# EAGLE design PIC_HP_LED_2023_01_22_A (EAGLE 9.6.1)
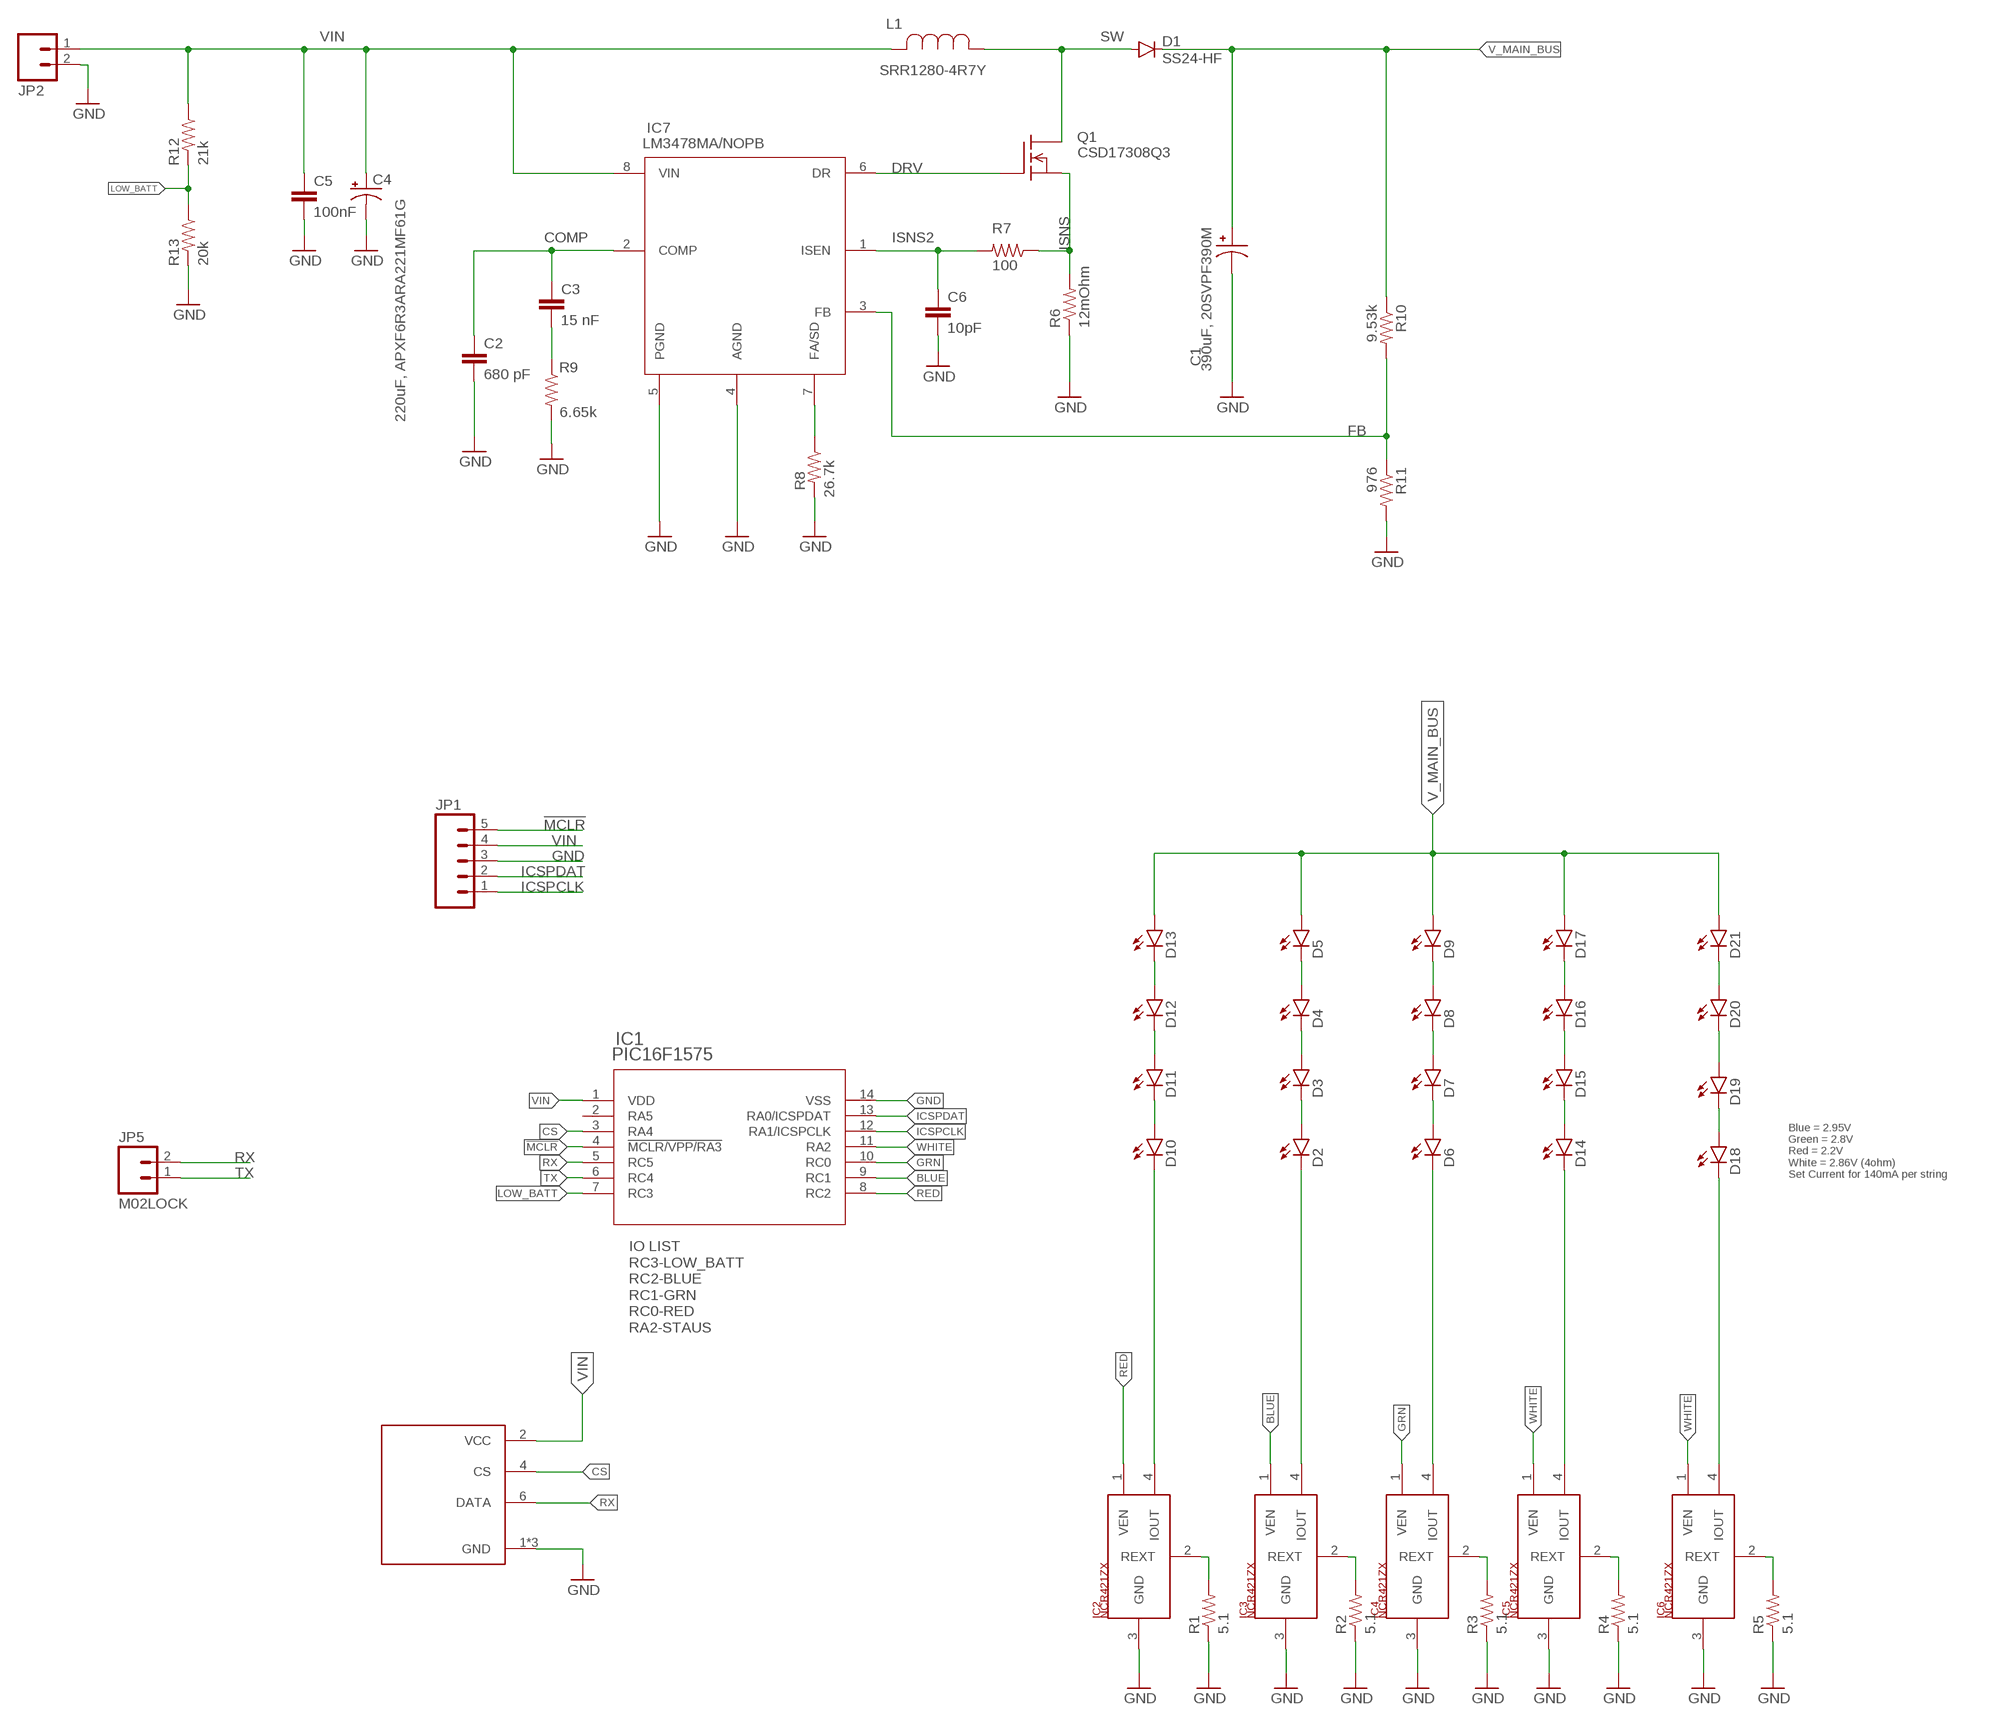
[diagram p0: schematic, sheet 1]

## Parts
C1  390uF, 20SVPF390M  20SVPF390M  [CAP_20SVPF390M]
C2  680 pF  CAP0805  [0805]
C3  15 nF  CAP0805  [0805]
C4  220uF, APXF6R3ARA221MF61G  CPOL-USUD-5X5,8  [UD-5X5,8_NICHICON]
C5  100nF  CAP0805  [0805]
C6  10pF  CAP0805  [0805]
D1  SS24-HF  DIODESMA-ALT  [SMA-DIODE_ALT]
D2  JE2835_B_G  [JE2835_BLUE]
D3  JE2835_B_G  [JE2835_BLUE]
D4  JE2835_B_G  [JE2835_BLUE]
D5  JE2835_B_G  [JE2835_BLUE]
D6  JE2835_B_G  [JE2835_BLUE]
D7  JE2835_B_G  [JE2835_BLUE]
D8  JE2835_B_G  [JE2835_BLUE]
D9  JE2835_B_G  [JE2835_BLUE]
D10  JE2835_B_G  [JE2835_BLUE]
D11  JE2835_B_G  [JE2835_BLUE]
D12  JE2835_B_G  [JE2835_BLUE]
D13  JE2835_B_G  [JE2835_BLUE]
D14  JE2835_B_G  [JE2835_BLUE]
D15  JE2835_B_G  [JE2835_BLUE]
D16  JE2835_B_G  [JE2835_BLUE]
D17  JE2835_B_G  [JE2835_BLUE]
D18  JE2835_B_G  [JE2835_BLUE]
D19  JE2835_B_G  [JE2835_BLUE]
D20  JE2835_B_G  [JE2835_BLUE]
D21  JE2835_B_G  [JE2835_BLUE]
IC1  PIC16F1575  PIC16F1503-I/SL  [SOIC14_SL]
IC2  NCR421ZX  [SOT223]
IC3  NCR421ZX  [SOT223]
IC4  NCR421ZX  [SOT223]
IC5  NCR421ZX  [SOT223]
IC6  NCR421ZX  [SOT223]
IC7  LM3478MA/NOPB  [M08A]
JP1  M05LOCK  [1X05_LOCK]
JP2  M02LOCK_LONGPADS  [1X02_LOCK_LONGPADS]
JP5  M02LOCK  [1X02_LOCK]
L1  SRR1280-4R7Y  SRR1260-100M  [IND_BOURNS_SRR1260]
Q1  CSD17308Q3  [TRANS_CSD17308Q3]
R1  5.1  RESISTOR1206  [1206]
R2  5.1  RESISTOR1206  [1206]
R3  5.1  RESISTOR1206  [1206]
R4  5.1  RESISTOR1206  [1206]
R5  5.1  RESISTOR1206  [1206]
R6  12mOhm  RESISTOR0805-RES  [0805]
R7  100  RESISTOR0805-RES  [0805]
R8  26.7k  RESISTOR0805-RES  [0805]
R9  6.65k  RESISTOR0805-RES  [0805]
R10  9.53k  RESISTOR0805-RES  [0805]
R11  976  RESISTOR0805-RES  [0805]
R12  21k  RESISTOR0805-RES  [0805]
R13  20k  RESISTOR0805-RES  [0805]
U$1  C2847244/YUANR4A  [C2847244/R4A]

## Nets
!MCLR: IC1.4(!MCLR/VPP/RA3) JP1.5
BLUE: IC1.9(RC1) IC3.1(VEN)
BLUE-: D2.C IC3.4(IOUT)
COMP: C2.1 C3.1 IC7.2(COMP)
CS: IC1.3(RA4) U$1.4(CS)
DRV: IC7.6(DR) Q1.G
FB: IC7.3(FB) R10.2 R11.1
GND: C1.2 C2.2 C4.- C5.2 C6.2 IC1.14(VSS) IC2.3(GND) IC3.3(GND) IC4.3(GND) IC5.3(GND) IC6.3(GND) IC7.4(AGND) IC7.5(PGND) JP1.3 JP2.2 R1.1 R2.1 R3.1 R4.1 R5.1 R6.1 R8.2 R9.2 R11.2 R13.2 U$1.1(GND) U$1.3(GND) U$1.5(GND)
GRN: IC1.10(RC0) IC4.1(VEN)
GRN-: D6.C IC4.4(IOUT)
ICSPCLK: IC1.12(RA1/ICSPCLK) JP1.1
ICSPDAT: IC1.13(RA0/ICSPDAT) JP1.2
ISNS: Q1.S1(S) Q1.S2(S) Q1.S3(S) R6.2 R7.1
ISNS2: C6.1 IC7.1(ISEN) R7.2
LOW_BATT: IC1.7(RC3) R12.2 R13.1
N$1: D10.A D11.C
N$2: D6.A D7.C
N$3: D2.A D3.C
N$4: D3.A D4.C
N$5: D7.A D8.C
N$6: D11.A D12.C
N$7: D12.A D13.C
N$8: D8.A D9.C
N$9: D4.A D5.C
N$10: IC2.2(REXT) R1.2
N$11: IC3.2(REXT) R2.2
N$12: IC4.2(REXT) R3.2
N$13: IC5.2(REXT) R4.2
N$14: D14.A D15.C
N$15: D15.A D16.C
N$16: D16.A D17.C
N$17: D14.C IC5.4(IOUT)
N$18: D18.A D19.C
N$19: D19.A D20.C
N$20: D20.A D21.C
N$21: D18.C IC6.4(IOUT)
N$22: IC6.2(REXT) R5.2
N$27: IC7.7(FA/SD) R8.1
N$31: C3.2 R9.1
RED: IC1.8(RC2) IC2.1(VEN)
RED-: D10.C IC2.4(IOUT)
RX: IC1.5(RC5) JP5.2 U$1.6(DATA)
SW: D1.A L1.1 Q1.5-8(D)
TX: IC1.6(RC4) JP5.1
V_MAIN_BUS: C1.1 D1.C D5.A D9.A D13.A D17.A D21.A R10.1
VIN: C4.+ C5.1 IC1.1(VDD) IC7.8(VIN) JP1.4 JP2.1 L1.2 R12.1 U$1.2(VCC)
WHITE: IC1.11(RA2) IC5.1(VEN) IC6.1(VEN)
Unconnected: IC1.2(RA5)

## Notes on the sheet
- Blue = 2.95V
  Green = 2.8V
  Red = 2.2V
  White = 2.86V (4ohm)
  Set Current for 140mA per string
- IO LIST
  RC3-LOW_BATT
  RC2-BLUE 
  RC1-GRN 
  RC0-RED
  RA2-STAUS

## Library data of the parts
C1 = 20SVPF390M:20SVPF390M: Check availability <https://pricing.snapeda.com/parts/20SVPF390M/Panasonic/view-part?ref=eda>; AVAILABILITY: In Stock; DESCRIPTION: 390F 20V Aluminum - Polymer Capacitors Radial, Can - SMD 14mOhm 5000 Hrs @ 105C; MF: Panasonic; MP: 20SVPF390M; PACKAGE: RADIAL-2 Panasonic; PRICE: None; PURCHASE-URL: https://pricing.snapeda.com/search/part/20SVPF390M/?ref=eda
C2 C3 C5 C6 = SparkFun-Capacitors:CAP: Capacitor Standard 0603 ceramic capacitor, and 0.1" leaded capacitor.
C4 = rcl:CPOL-US: POLARIZED CAPACITOR, American symbol; SPICEPREFIX: C
D1 = SparkFun-DiscreteSemi:DIODE: Diode These are standard reverse protection diodes and small signal diodes. SMA package can handle up to about 1A. SOD-323 can handle about 200mA. What the SOD-323 package when ordering, there are some mfgs out there that are 5-pin packages.
D2-D21 = Cree2835:JE2835_B_G: Footprint for JE2835 BLUE or GREEN Mid-Power LEDs - Single Color 2835 Mid-Power ColorGreen 520-540nm Mid-Power LEDs - Single Color 2835 Mid-Power ColorBlue 465-480nm Blue and Red have different foot prints.
IC1 = PIC16F15323:PIC16F1503-I/SL; BUILT_BY: EMA_UL_Team; MANUFACTURER_PART_NUMBER: PIC16F1503-I/SL; VENDOR: Microchip
IC2-IC6 = NCR421ZX:NCR421ZX
IC7 = LM3478MA:LM3478MA/NOPB; COPYRIGHT: Copyright (C) 2022 Ultra Librarian. All rights reserved.; DIGI-KEY_PART_NUMBER_1: LM3478MA/NOPB-ND; MANUFACTURER_PART_NUMBER: LM3478MA/NOPB; MFR_NAME: Texas Instruments
JP1 = SparkFun-Connectors:M05: Header 5 Standard 5-pin 0.1" header. Use with straight break away headers (SKU : PRT-00116), right angle break away headers (PRT-00553), swiss pins (PRT-00743), machine pins (PRT-00117), and female headers (PRT-00115). Molex polarized connector foot print use with SKU : PRT-08230 with associated crimp pins and housings.
JP2 JP5 = SparkFun-Connectors:M02: Standard 2-pin 0.1" header. Use with - straight break away headers ( PRT-00116) - right angle break away headers (PRT-00553) - swiss pins (PRT-00743) - machine pins (PRT-00117) - female headers (PRT-00115) Molex polarized connector foot print use with: PRT-08233 with associated crimp pins and housings. 2.54_SCREWTERM for use with PRT-10571. 3.5mm Screw Terminal footprints for PRT-08084 5mm Screw Terminal footprints for use with PRT-08432
L1 = SRR1260 Series:SRR1260-100M; COPYRIGHT: Copyright (C) 2021 Ultra Librarian. All rights reserved.; DIGI-KEY_PART_NUMBER_1: SRR1260-100MCT-ND; DIGI-KEY_PART_NUMBER_2: SRR1260-100MDKR-ND; DIGI-KEY_PART_NUMBER_3: SRR1260-100MTR-ND; MANUFACTURER_PART_NUMBER: SRR1260-100M; MFR_NAME: Bourns Electronics
Q1 = CSD17308Q3:CSD17308Q3: Check availability <https://pricing.snapeda.com/parts/CSD17308Q3/Texas%20Instruments/view-part?ref=eda>; AVAILABILITY: In Stock; DESCRIPTION: 30-V, N channel NexFET™ power MOSFET, single SON 3 mm x 3 mm, 11.8 mOhm; MF: Texas Instruments; MP: CSD17308Q3; PACKAGE: VSON-CLIP-8 Texas Instruments; PRICE: None; PURCHASE-URL: https://pricing.snapeda.com/search/part/CSD17308Q3/?ref=eda
R1-R13 = SparkFun-Resistors:RESISTOR: Resistor Basic schematic elements and footprints for 0603, 1206, and PTH resistors.
U$1 = Feng Niao RF Library:C2847244/YUANR4A: Feng Niao RF C2847244 Yuan R4A small, red, rectangular module with built in antenna. With sleep pin.

## Board
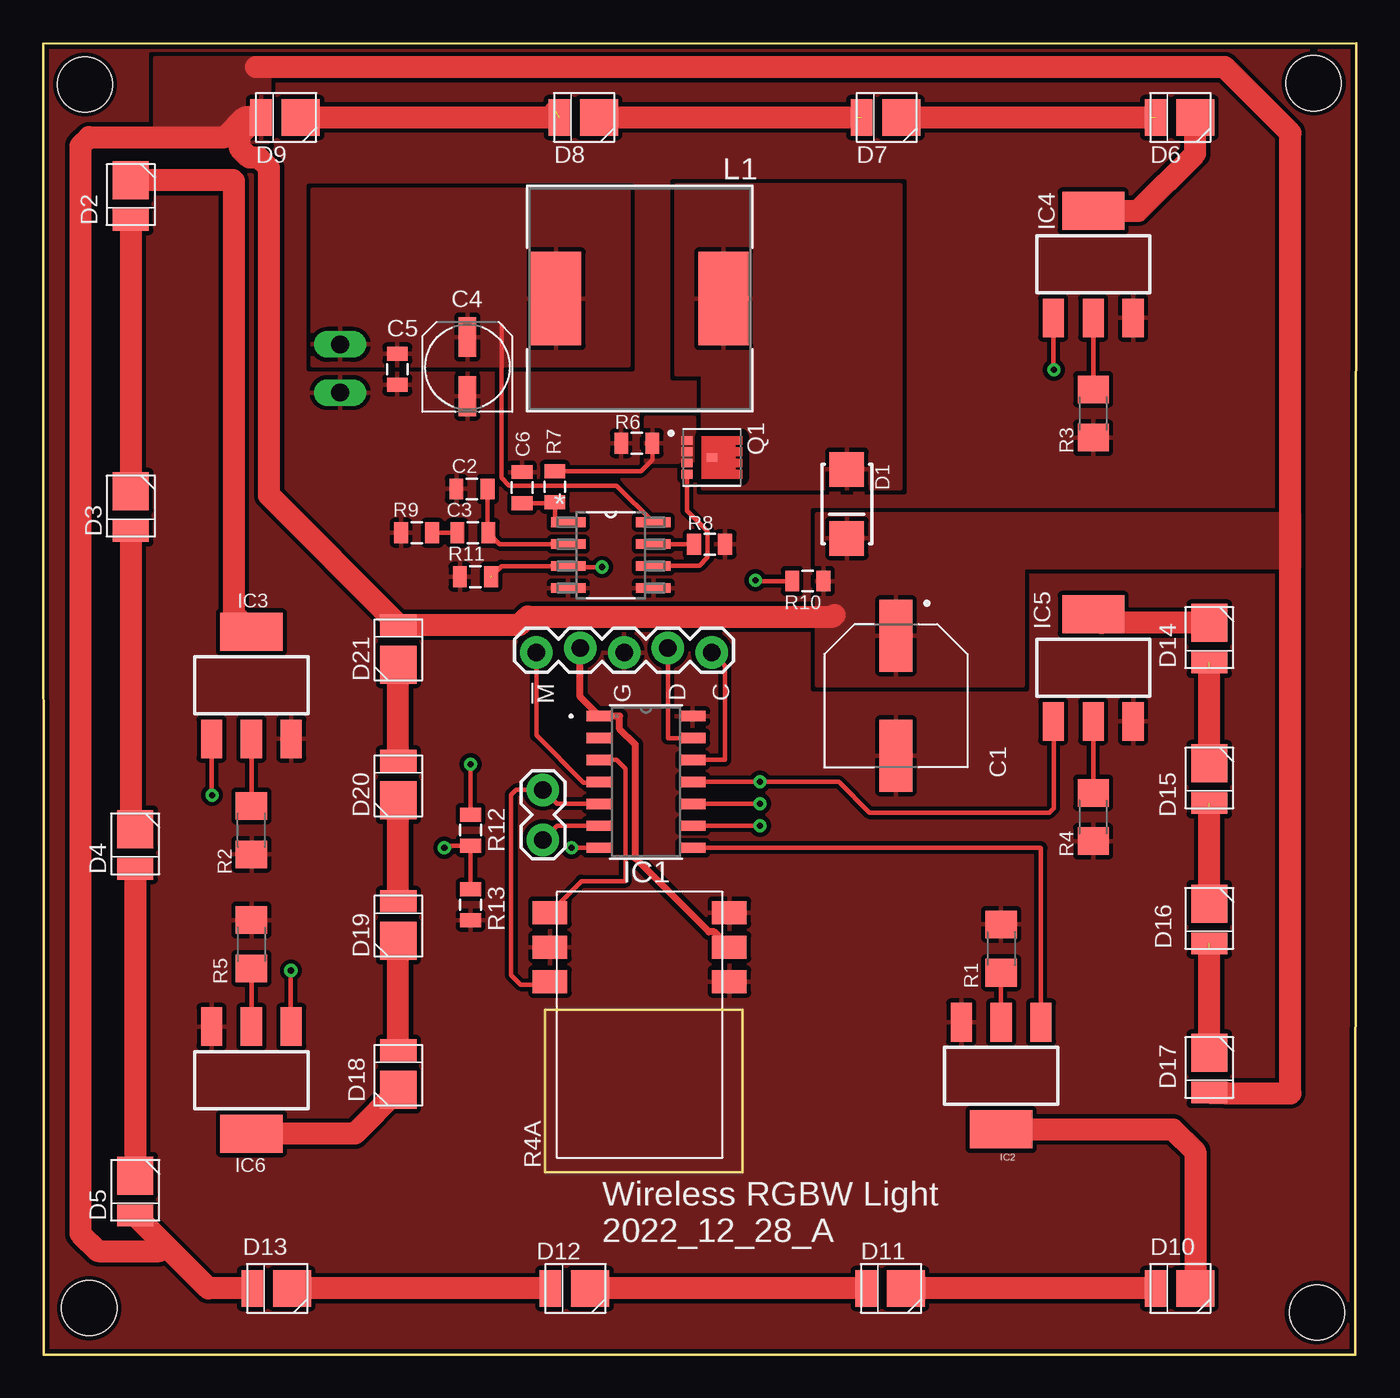
[diagram p1: board, top side]
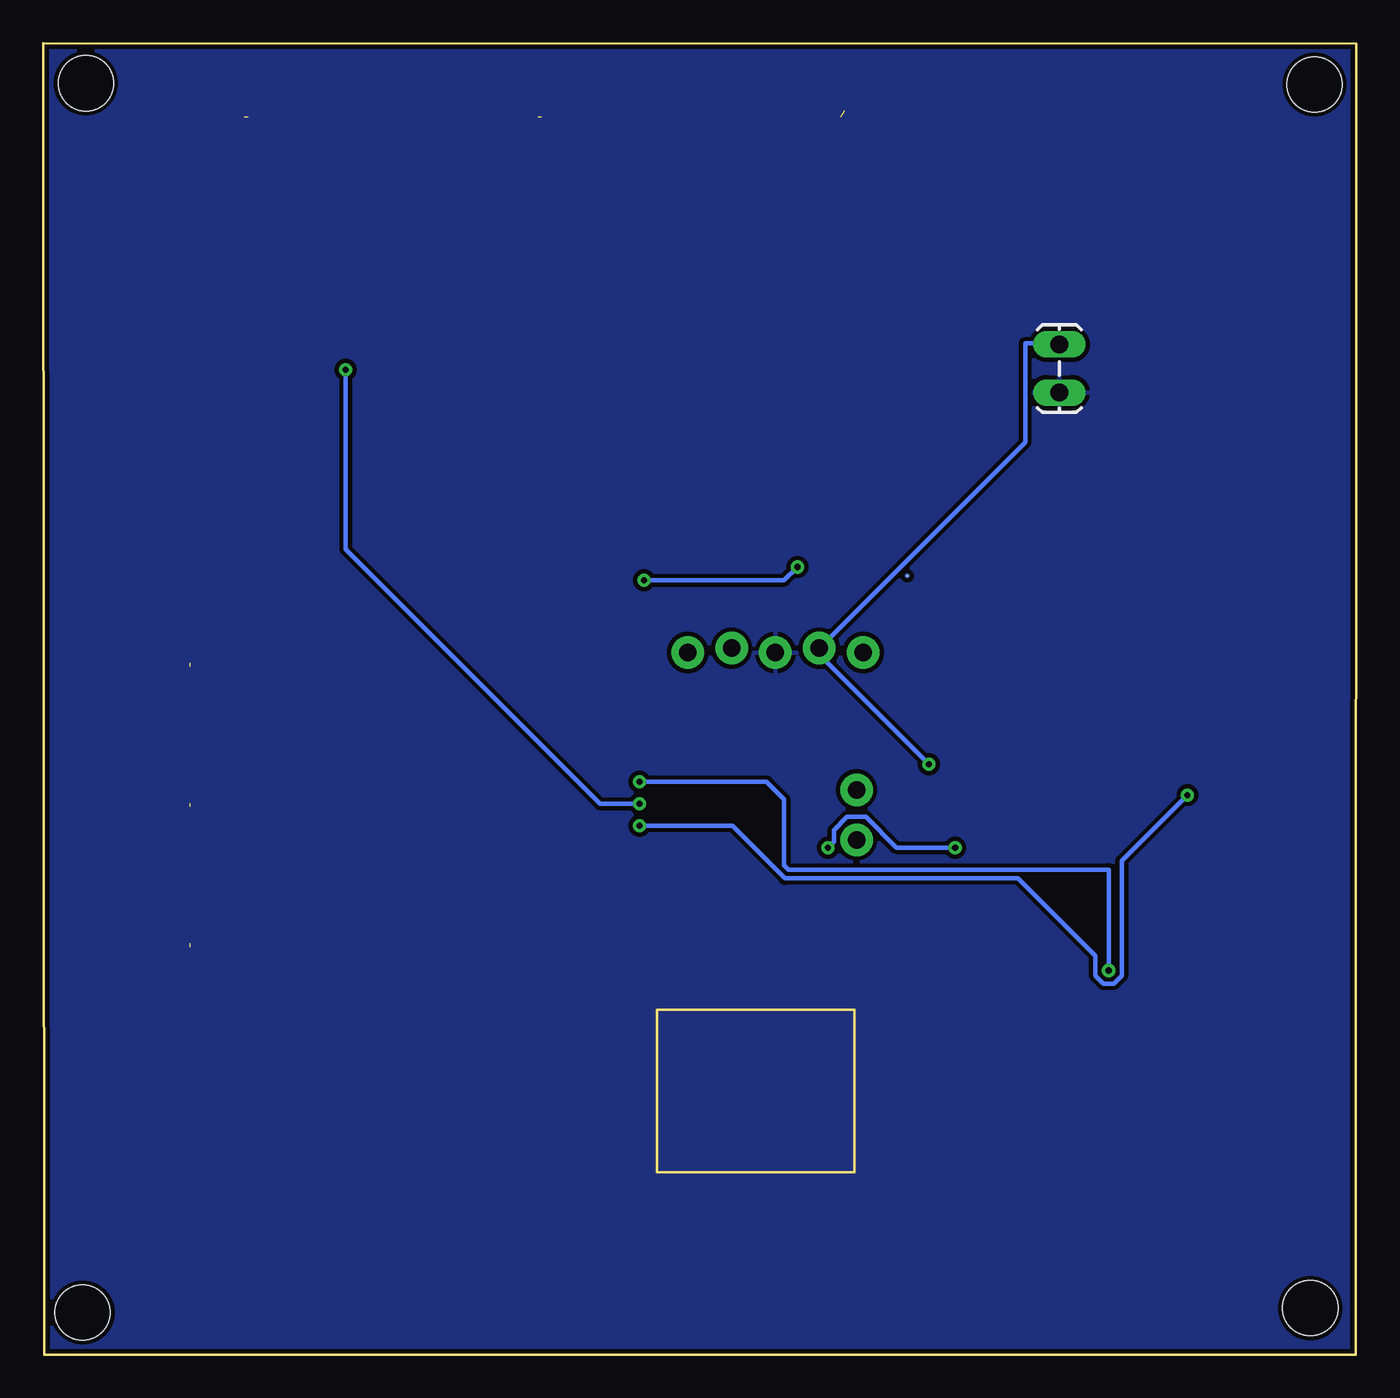
[diagram p2: board, bottom side, seen from below]

Size 76.08 x 75.96 mm. Coordinates in mm from the lower left corner, seen from the top.
Outline: 76.08,75.96 76.02,0 0.05,0 0,75.93 76.08,75.96
Copper layers (1*16): Top 0.035mm / dielectric 1.5mm / Bottom 0.035mm
Design rules "default": minimum track width 10mil, minimum drill 0.35mm, track to track 10mil, track to pad 10mil, pad to pad 10mil, via to via 10mil, smd to smd 6mil, copper to edge 10mil, drill to drill 6mil, minimum pad ring 10mil, minimum via ring 8mil, stop-mask expansion 4mil, vias tented up to drill 0mil, thermal gap 10mil
Holes 3.17 mm at 2.67,2.69 2.41,73.56 73.61,73.64 73.79,2.44
Milling: area 29.1,10.6 to 40.5,20

### Footprints (pad centres in the part's own frame; a part is rotated, then mirrored left to right if it is on the bottom)
CAP_20SVPF390M = smd 4.15 x 1.9: 1 -3.475,0; 2 3.475,0
0805 = smd 0.8 x 1.2: 1 -0.9,0; 2 0.9,0
UD-5X5,8_NICHICON = smd 2.3 x 1: + 1.725,0; - -1.7,0
SMA-DIODE_ALT = smd 2 x 2: A -2,0; C 2,0
JE2835_BLUE = smd 1.25 x 2.1: A 0.3,1.4 | smd 2.2 x 2.1: C 2.6,1.4
SOIC14_SL = smd 1.5 x 0.6: 1 -2.7,3.81; 2 -2.7,2.54; 3 -2.7,1.27; 4 -2.7,0; 5 -2.7,-1.27; 6 -2.7,-2.54; 7 -2.7,-3.81; 8 2.7,-3.81; 9 2.7,-2.54; 10 2.7,-1.27; 11 2.7,0; 12 2.7,1.27; 13 2.7,2.54; 14 2.7,3.81
SOT223 = smd 1.219 x 2.235: 1 -2.311,-3.099; 2 0,-3.099; 3 2.311,-3.099 | smd 3.6 x 2.2: 4 0,3.099
M08A = smd 1.981 x 0.559: 1 -2.464,1.905; 2 -2.464,0.635; 3 -2.464,-0.635; 4 -2.464,-1.905; 5 2.464,-1.905; 6 2.464,-0.635; 7 2.464,0.635; 8 2.464,1.905
1X05_LOCK = drill 1.016 pad 1.88: 1 0,0.127; 2 2.54,-0.127; 3 5.08,0.127; 4 7.62,-0.127; 5 10.16,0.127
1X02_LOCK_LONGPADS = drill 1.016 long: 1 -0.127,0; 2 2.667,0
1X02_LOCK = drill 1.016 pad 1.88: 1 -0.178,0; 2 2.718,0
IND_BOURNS_SRR1260 = smd 2.896 x 5.41: 1 -4.851,0; 2 4.851,0
TRANS_CSD17308Q3 = smd 0.63 x 0.5: 5-8 0,0; G -1.435,-0.975; S1 -1.435,0.975; S2 -1.435,0.325; S3 -1.435,-0.325
1206 = smd 1.6 x 1.8: 1 -1.4,0; 2 1.4,0
C2847244/R4A = smd 2 x 1.33: 1 -0.4,1.2; 2 -0.4,3.2; 3 -0.4,5.2; 4 10,1.2; 5 10,3.2; 6 10,5.2

### Placement (x,y rotation side)
C1  49.41,38.17 270 top
C2  24.84,50.14 180 top
C3  24.89,47.6 180 top
C4  24.58,57.21 90 top
C5  20.52,57.07 270 top
C6  27.74,50.22 90 top
D1  46.56,49.28 270 top
D2  6.48,65.43 90 top
D3  6.48,47.4 90 top
D4  6.73,27.84 90 top
D5  6.73,7.77 90 top
D6  64.14,70.26 0 top
D7  47.12,70.26 0 top
D8  29.59,70.26 0 top
D9  12.32,70.26 0 top
D10  64.14,2.44 0 top
D11  47.37,2.44 0 top
D12  29.08,2.44 0 top
D13  11.81,2.44 0 top
D14  68.96,39.78 90 top
D15  68.96,31.65 90 top
D16  68.96,23.52 90 top
D17  68.96,14.89 90 top
D18  19.18,17.93 270 top
D19  19.18,26.57 270 top
D20  19.18,34.7 270 top
D21  19.18,42.57 270 top
IC1  34.93,33.17 0 top
IC2  55.5,16.16 180 top
IC3  12.07,38.76 0 top
IC4  60.83,63.15 0 top
IC5  60.83,39.78 0 top
IC6  12.07,15.9 180 top
IC7  32.89,46.31 0 top
JP1  38.74,40.79 180 top
JP2  17.21,58.38 270 bottom
JP5  28.96,30 90 top
L1  34.57,61.16 180 top
Q1  38.74,51.97 0 top
R1  55.5,23.52 270 top
R2  12.07,30.38 90 top
R3  60.83,54.51 90 top
R4  60.83,31.14 90 top
R5  12.07,23.78 270 top
R6  34.39,52.78 0 top
R7  29.64,50.27 270 top
R8  38.61,46.94 0 top
R9  21.64,47.6 180 top
R10  44.3,44.81 180 top
R11  25.05,45.06 180 top
R12  24.77,30.38 270 top
R13  24.77,26.06 270 top
U$1  39.36,26.81 180 top

### Tracks (layer width: path | path; a pad name or v marks a point on that pad's centre or on a via)
!MCLR
  Top 0.254: IC1.4 32.18,33.13 31.32,33.13 28.58,35.87 JP1.5
BLUE  (via drill 0.35)
  Top 0.254: IC3.1 9.76,32.44 v9.78,32.41 | v41.53,30.63 IC1.9
  Bottom 0.254: v41.53,30.63 36.15,30.63 33.1,27.59 19.6,27.59 15.11,23.1 15.11,21.94 14.67,21.49 14.04,21.49 13.59,21.94 13.59,28.6 v9.78,32.41
BLUE-
  Top 1.27: IC3.4 11.05,42.88 11.05,67.97 10.99,68.03 D2.C
COMP
  Top 0.254: C2.1 25.74,47.65 C3.1 26.45,46.94 IC7.2
CS
  Top 0.254: U$1.4 31.18,27.43 33.73,27.43 33.73,33.93 33.22,34.44 IC1.3
DRV
  Top 0.254: IC7.6 35.38,45.71 38.01,45.71 38.49,46.18 38.49,47.7 37.3,48.89 Q1.G
FB  (via drill 0.35)  (1 unrouted)
  Top 0.254: R10.2 41.33,44.81 v41.28,44.86 | v32.39,45.62 30.48,45.62 IC7.3 26.56,45.67 R11.1
  Bottom 0.254: 26.04,45.11 26,45.11 | v41.28,44.86 33.15,44.86 v32.39,45.62
GND
  pour Top (rank 6): -14.73,108.36 109.35,108.36 109.35,-8.48 -14.73,-8.48
  pour Bottom (rank 6): -29.21,118.65 115.32,118.65 115.32,-9.75 -29.21,-9.75
GRN  (via drill 0.35)
  Top 0.254: 37.88,31.9 IC1.10 v41.53,31.9 | IC4.1 58.52,57.07 v58.55,57.05
  Bottom 0.254: v58.55,57.05 58.55,46.64 43.82,31.9 v41.53,31.9
GRN-
  Top 1.27: IC4.4 63.42,66.25 66.74,69.56 D6.C
ICSPCLK
  Top 0.254: JP1.1 39.5,39.91 39.5,34.44 IC1.12
ICSPDAT
  Top 0.254: IC1.13 36.2,35.71 JP1.2
ISNS
  Top 0.254: 37.28,52.27 Q1.S2 | R7.1 34.63,51.17 35.29,51.83 R6.2
  pour Top (isolate 0.406): 34.93,54.26 34.93,51.72 37.72,51.72 37.72,54.26
ISNS2
  Top 0.254: C6.1 29.59,49.32 R7.2 29.64,48.21 29.59,48.16 30.37,48.16 IC7.1
LOW_BATT  (via drill 0.35)
  Top 0.254: R13.1 R12.2 23.36,29.48 v23.24,29.36 | IC1.7 v30.61,29.36
  Bottom 0.254: v30.61,29.36 30.28,29.69 30.28,30.37 29.5,31.14 28.41,31.14 26.63,29.36 v23.24,29.36
N$1
  Top 1.27: D10.A D11.C
N$2  (1 unrouted)
  Top 1.27: D7.C 64.21,71.66
N$3
  Top 1.27: D2.A D3.C
N$4
  Top 1.27: D3.A 5.08,30.69 D4.C
N$5  (1 unrouted)
  Top 1.27: D8.C 47.19,71.66
N$6
  Top 1.27: D11.A D12.C
N$7
  Top 1.27: D12.A D13.C
N$8  (1 unrouted)
  Top 1.27: D9.C 29.66,71.66 29.66,72.04
N$9
  Top 1.27: D4.A D5.C
N$10
  Top 0.254: IC2.2 R1.2
N$11
  Top 0.254: R2.2 IC3.2 | IC3.2 12.07,35.97 12.32,36.22 12.32,35.92 IC3.2
N$12
  Top 0.254: R3.2 IC4.2
N$13
  Top 0.254: R4.2 IC5.2
N$14  (1 unrouted)
  Top 1.27: D15.C 67.56,39.85
N$15  (1 unrouted)
  Top 1.27: D16.C 67.56,31.72
N$16  (1 unrouted)
  Top 1.27: D17.C 67.56,23.59
N$17
  Top 1.27: D14.C 61.33,42.38 IC5.4
N$18
  Top 1.27: D18.A D19.C
N$19
  Top 1.27: D19.A D20.C
N$20
  Top 1.27: D20.A D21.C
N$21
  Top 1.27: D18.C 18.05,12.8 IC6.4
N$22
  Top 0.254: IC6.2 R5.2
N$27
  Top 0.254: IC7.7 R8.1
N$31
  Top 0.254: R9.1 C3.2
RED
  Top 0.254: IC2.1 57.81,29.34 57.79,29.36 IC1.8
RED-
  Top 1.27: IC2.4 65.46,13.06 66.74,11.78 D10.C
RX
  Top 0.254: IC1.5 29.77,31.9 JP5.2 27.4,32.72 27.12,32.43 27.12,21.98 27.66,21.43 29.18,21.43 U$1.6
SW
  pour Top (isolate 0.406): 36.7,67.72 49.66,67.72 49.66,50.19 38.23,50.19 38.23,56.8 36.7,56.8
TX
  Top 0.254: IC1.6 29.77,30.63 JP5.1
V_MAIN_BUS
  Top 1.27: D13.A 9.57,3.84 7.07,6.33 | 7.07,6.33 D5.A | D9.A 11.69,71.66 | 11.69,71.66 10.54,70.51 2.67,70.51 2.16,70 2.16,7.01 3.18,6 6.73,6 7.07,6.33 | D17.A 68.49,15.19 68.53,15.14 72.26,15.14 72.26,70.77 68.45,74.58 12.32,74.58 | 11.69,71.66 11.69,70.94 11.39,70.64 11.39,69.87 11.94,69.33 12.48,69.33 13.08,68.73 13.08,49.77 D21.A 27.59,42.27 28.07,42.75 45.77,42.75 45.85,42.83
  pour Top (isolate 0.406): 44.83,48.67 44.83,38.76 56.77,38.76 56.77,48.67
  pour Top: 6.48,75.08 6.48,70.26 13.08,70.26 13.08,75.08
  pour Top (isolate 0.406): 56.01,48.67 72.77,48.67 72.77,45.62 56.77,45.62 56.01,46.38
VIN  (via drill 0.35)
  Top 0.254: IC7.8 33.23,50.34 26.98,50.34 26.54,50.78 26.54,59.59 | R12.1 v24.77,34.19
  Top 0.406: JP1.4 31.12,38.09 IC1.1 33.4,36.98 33.4,36.23 34.31,35.33 34.31,28.74 38.57,24.49 38.88,24.49 U$1.2
  Bottom 0.254: JP2.1 17.27,58.57 19.18,58.57 19.18,52.86 JP1.4 31.12,40.54 v24.77,34.19
  pour Top (isolate 0.406): 15.62,57.3 33.91,57.3 33.91,67.46 15.62,67.46
WHITE  (via drill 0.35)
  Top 0.254: IC1.11 v41.53,33.17 46.1,33.17 47.88,31.4 58.29,31.4 58.55,31.65 58.55,36.65 IC5.1 | v14.35,22.25 14.35,19.03 IC6.1
  Bottom 0.254: v41.53,33.17 34.16,33.17 33.15,32.16 33.15,28.35 32.89,28.09 14.35,28.09 v14.35,22.25

### Text on the board
tPlace: R4A | Wireless RGBW Light / 2022_12_28_A
bOrigins: +
tNames: !M | G | D | C